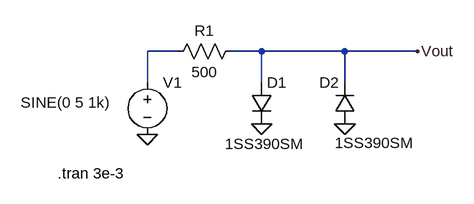
[diagram p0: schematic Limiter or Diode Clamp.asc]
Limiter or Diode Clamp.asc, the LTspice schematic file:
Version 4
SHEET 1 880 680
WIRE -32 80 -80 80
WIRE 96 80 48 80
WIRE 224 80 96 80
WIRE 336 80 224 80
WIRE -80 128 -80 80
WIRE 96 128 96 80
WIRE 224 128 224 80
FLAG 336 80 Vout
FLAG -80 208 0
FLAG 96 192 0
FLAG 224 192 0
SYMBOL diode 80 128 R0
WINDOW 3 250 93 Right 2
SYMATTR InstName D1
SYMATTR Value 1SS390SM
SYMBOL diode 240 192 R180
WINDOW 0 24 64 Left 2
WINDOW 3 79 -31 Left 2
SYMATTR InstName D2
SYMATTR Value 1SS390SM
SYMBOL voltage -80 112 R0
WINDOW 3 -195 47 Left 2
WINDOW 123 0 0 Left 0
WINDOW 39 0 0 Left 0
SYMATTR InstName V1
SYMATTR Value SINE(0 5 1k)
SYMBOL res 64 64 R90
WINDOW 0 0 56 VBottom 2
WINDOW 3 32 56 VTop 2
SYMATTR InstName R1
SYMATTR Value 500
TEXT -218 268 Left 2 !.tran 3e-3

The netlist it stands for:
* Limiter or Diode Clamp.asc
D1 Vout 0 1SS390SM
D2 0 Vout 1SS390SM
V1 N001 0 SINE(0 5 1k)
R1 Vout N001 500
.model D D
.lib standard.dio
.tran 3e-3
.backanno
.end